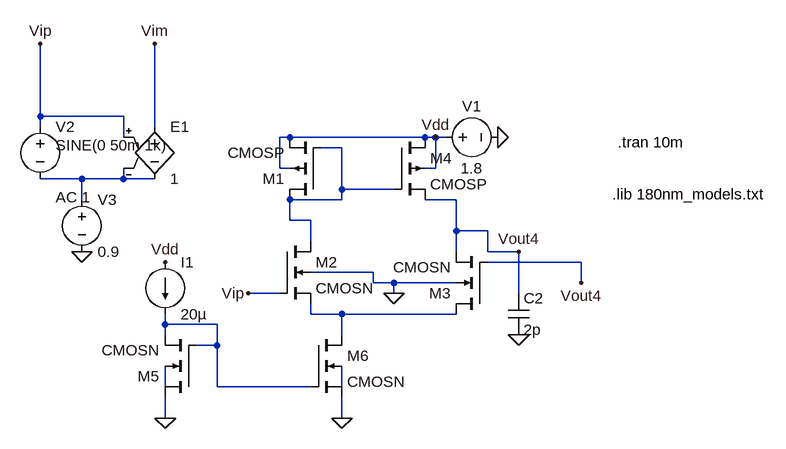
[diagram p0: schematic Voltage_follower.asc]
Voltage_follower.asc, the LTspice schematic file:
Version 4
SHEET 1 1720 2724
WIRE -1136 1520 -1136 1408
WIRE -1008 1520 -1136 1520
WIRE -1136 1536 -1136 1520
WIRE -960 1536 -960 1408
WIRE -1008 1552 -1008 1520
WIRE -752 1552 -768 1552
WIRE -544 1552 -752 1552
WIRE -528 1552 -544 1552
WIRE -512 1552 -528 1552
WIRE -672 1568 -704 1568
WIRE -768 1600 -768 1552
WIRE -752 1600 -768 1600
WIRE -528 1600 -528 1552
WIRE -528 1600 -544 1600
WIRE -1072 1616 -1136 1616
WIRE -1008 1616 -1008 1600
WIRE -1008 1616 -1072 1616
WIRE -960 1616 -1008 1616
WIRE -672 1632 -672 1568
WIRE -592 1632 -672 1632
WIRE -1072 1648 -1072 1616
WIRE -672 1648 -672 1632
WIRE -672 1648 -752 1648
WIRE -496 1648 -544 1648
WIRE -752 1680 -752 1648
WIRE -720 1680 -752 1680
WIRE -496 1696 -496 1648
WIRE -448 1696 -496 1696
WIRE -720 1712 -720 1680
WIRE -496 1728 -496 1696
WIRE -448 1728 -448 1696
WIRE -400 1728 -448 1728
WIRE -304 1744 -448 1744
WIRE -624 1760 -720 1760
WIRE -624 1776 -624 1760
WIRE -592 1776 -624 1776
WIRE -496 1776 -592 1776
WIRE -304 1776 -304 1744
WIRE -768 1792 -816 1792
WIRE -592 1792 -592 1776
WIRE -400 1792 -400 1728
WIRE -720 1824 -720 1808
WIRE -672 1824 -720 1824
WIRE -496 1824 -672 1824
WIRE -944 1840 -944 1824
WIRE -864 1840 -944 1840
WIRE -944 1856 -944 1840
WIRE -672 1856 -672 1824
WIRE -864 1872 -864 1840
WIRE -864 1872 -896 1872
WIRE -944 1936 -944 1904
WIRE -864 1936 -864 1872
WIRE -720 1936 -864 1936
WIRE -672 1936 -672 1904
WIRE -944 1984 -944 1952
WIRE -672 1984 -672 1952
FLAG -432 1552 0
FLAG -592 1792 0
FLAG -944 1984 0
FLAG -672 1984 0
FLAG -528 1552 Vdd
FLAG -944 1744 Vdd
FLAG -816 1792 Vip
FLAG -304 1776 Vout4
FLAG -1072 1728 0
FLAG -1136 1408 Vip
FLAG -960 1408 Vim
FLAG -400 1728 Vout4
FLAG -400 1856 0
SYMBOL pmos4 -704 1648 R180
SYMATTR InstName M1
SYMATTR Value CMOSP
SYMATTR Value2 l=0.6u w=60u
SYMBOL pmos4 -592 1552 R0
SYMATTR InstName M4
SYMATTR Value CMOSP
SYMATTR Value2 l=0.6u w=60u
SYMBOL nmos4 -768 1712 R0
SYMATTR InstName M2
SYMATTR Value CMOSN
SYMATTR Value2 l=5u w=60u
SYMBOL nmos4 -448 1824 R180
SYMATTR InstName M3
SYMATTR Value CMOSN
SYMATTR Value2 l=5u w=60u
SYMBOL voltage -528 1552 R270
WINDOW 0 32 56 VTop 2
WINDOW 3 -32 56 VBottom 2
WINDOW 123 0 0 Left 0
WINDOW 39 0 0 Left 0
SYMATTR InstName V1
SYMATTR Value 1.8
SYMBOL nmos4 -896 1952 R180
SYMATTR InstName M5
SYMATTR Value CMOSN
SYMATTR Value2 l=5u w=50u
SYMBOL nmos4 -720 1856 R0
SYMATTR InstName M6
SYMATTR Value CMOSN
SYMATTR Value2 l=5u w=50u m=10
SYMBOL current -944 1744 R0
WINDOW 123 0 0 Left 0
WINDOW 39 0 0 Left 0
SYMATTR InstName I1
SYMATTR Value 20µ
SYMBOL voltage -1136 1520 R0
WINDOW 3 24 44 Left 2
WINDOW 123 24 124 Left 2
WINDOW 39 0 0 Left 0
SYMATTR Value SINE(0 50m 1k)
SYMATTR Value2 AC 1
SYMATTR InstName V2
SYMBOL voltage -1072 1632 R0
WINDOW 123 0 0 Left 0
WINDOW 39 0 0 Left 0
SYMATTR InstName V3
SYMATTR Value 0.9
SYMBOL e -960 1520 R0
SYMATTR InstName E1
SYMATTR Value 1
SYMBOL cap -416 1792 R0
SYMATTR InstName C2
SYMATTR Value 2p
TEXT -256 1640 Left 2 !.lib 180nm_models.txt
TEXT -248 1560 Left 2 !.tran 10m

The netlist it stands for:
* Voltage_follower.asc
M1 N001 N001 Vdd Vdd CMOSP l=0.6u w=60u
M4 Vdd N001 Vout4 Vdd CMOSP l=0.6u w=60u
M2 N001 Vip N003 0 CMOSN l=5u w=60u
M3 N003 Vout4 Vout4 0 CMOSN l=5u w=60u
V1 Vdd 0 1.8
M5 0 N004 N004 N005 CMOSN l=5u w=50u
M6 N003 N004 0 N006 CMOSN l=5u w=50u m=10
I1 Vdd N004 20µ
V2 Vip N002 SINE(0 50m 1k) AC 1
V3 N002 0 0.9
E1 Vim N002 Vip N002 1
C2 Vout4 0 2p
.model NMOS NMOS
.model PMOS PMOS
.lib standard.mos
.lib 180nm_models.txt
.tran 10m
.backanno
.end